# EasyEDA Pro project EasyEDA_Audio_Amp.epro

# Schematic Schematic1
Board Name: Board1; Create Date: 2026-08-29; Page Name: P1; Project Name: audio amp; Schematic Name: Schematic1; Update Date: 2026-08-30; Company: EasyEDA.com; Page Size: A4; Version: V1.0
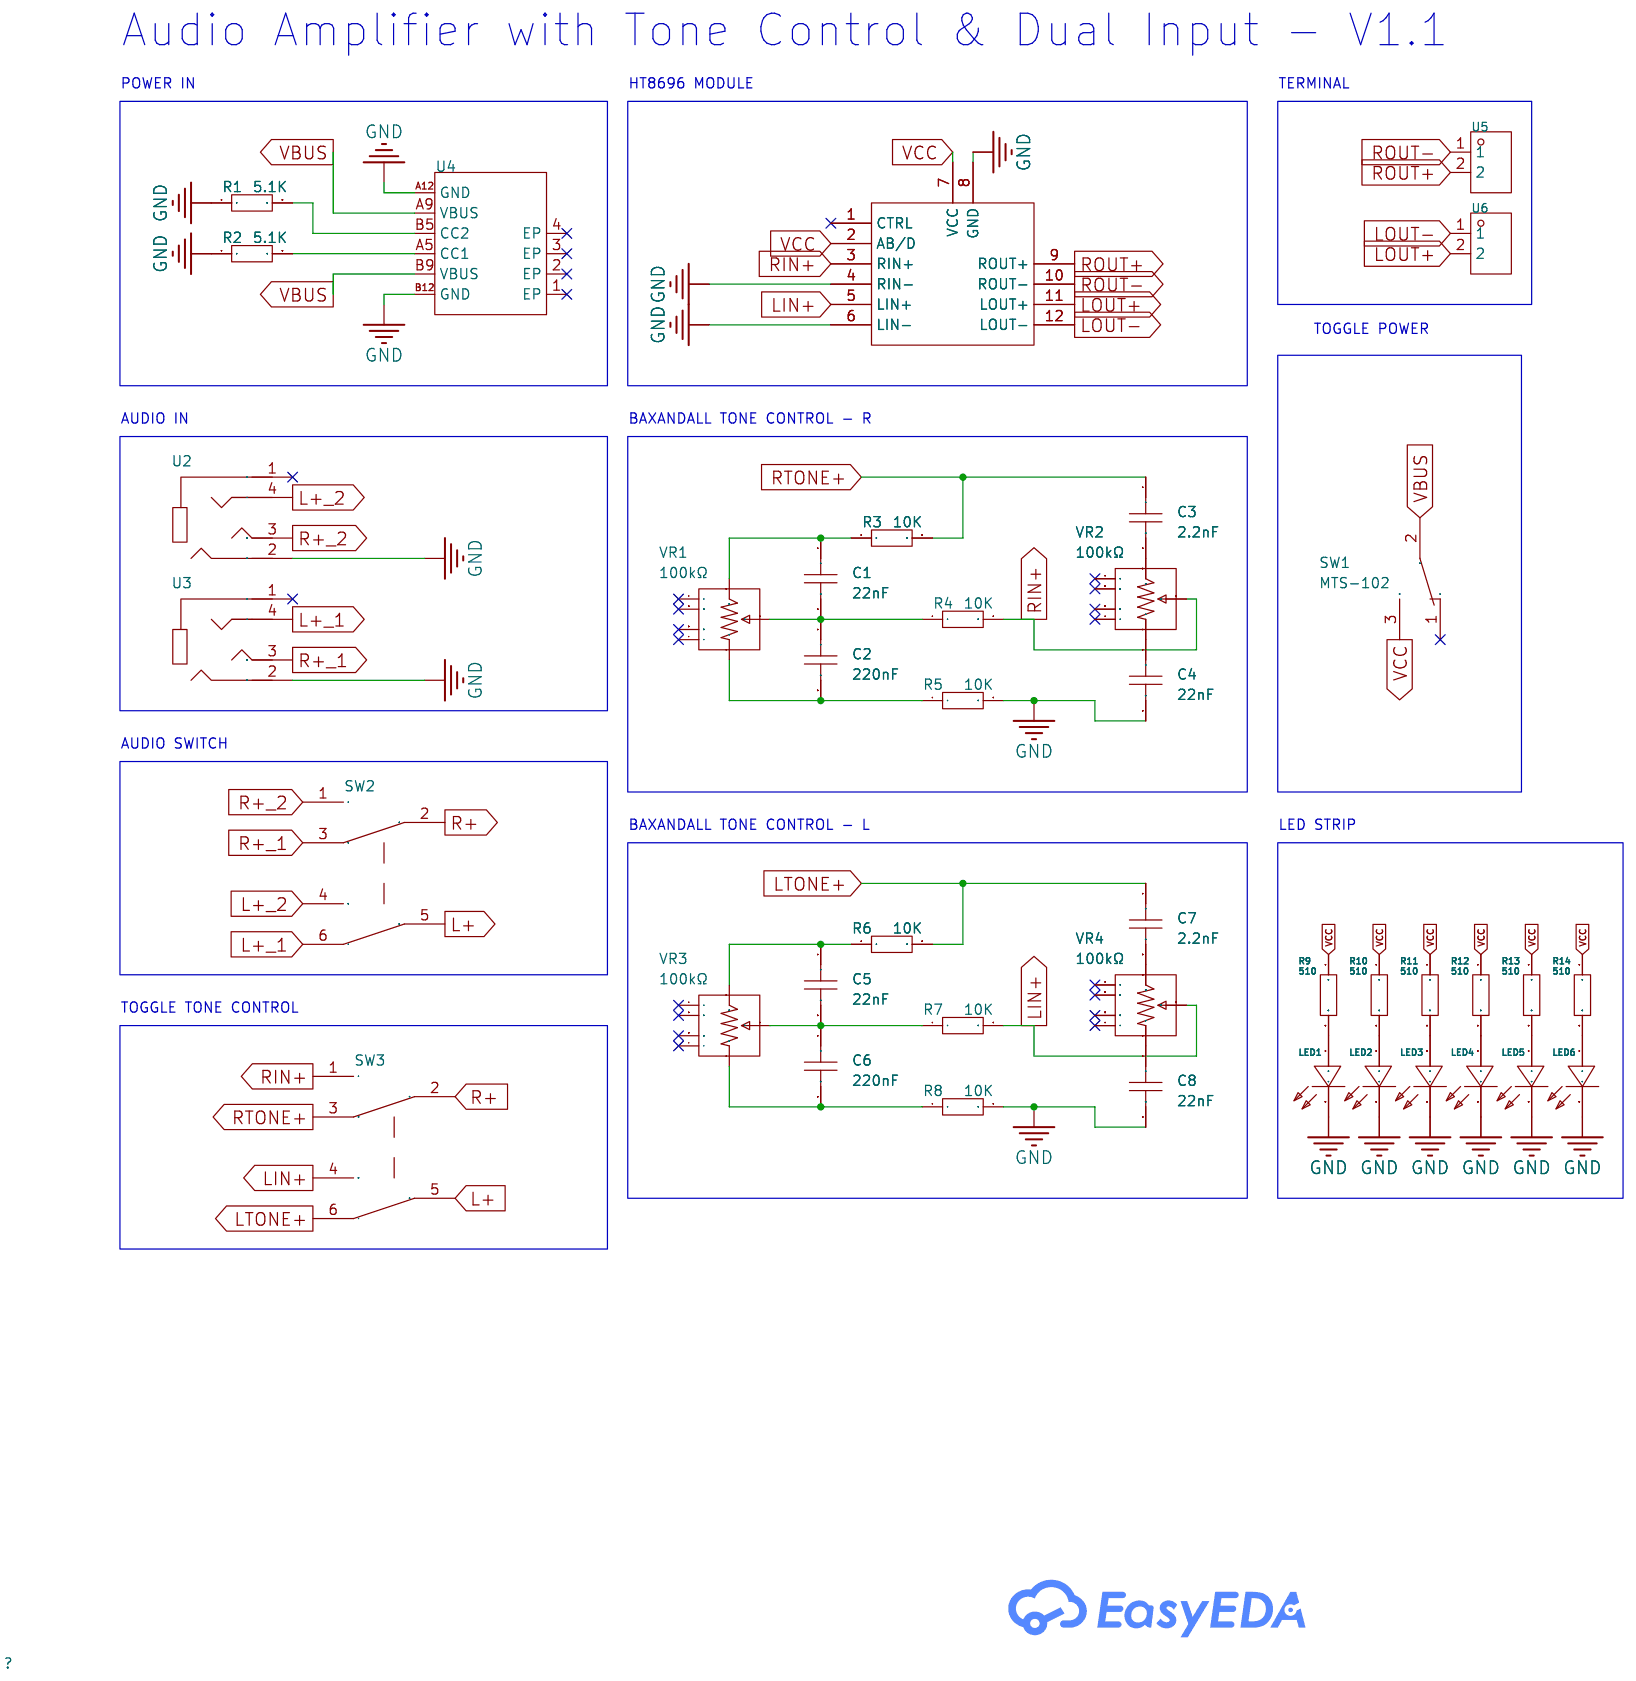
[diagram p0: schematic sheet]

## Parts
C1  22nF  [C0805]
C2  220nF  [C0805]
C3  2.2nF  [C0805]
C4  22nF  [C0805]
C5  22nF  [C0805]
C6  220nF  [C0805]
C7  2.2nF  [C0805]
C8  22nF  [C0805]
LED1  KT-0805G  [LED0805-R-RD]
LED2  KT-0805G  [LED0805-R-RD]
LED3  KT-0805G  [LED0805-R-RD]
LED4  KT-0805G  [LED0805-R-RD]
LED5  KT-0805G  [LED0805-R-RD]
LED6  KT-0805G  [LED0805-R-RD]
R1  5.1K  [R0805]
R2  5.1K  [R0805]
R3  10K  [R0805]
R4  10K  [R0805]
R5  10K  [R0805]
R6  10K  [R0805]
R7  10K  [R0805]
R8  10K  [R0805]
R9  510  [R0805]
R10  510  [R0805]
R11  510  [R0805]
R12  510  [R0805]
R13  510  [R0805]
R14  510  [R0805]
SW1  MTS-102  [MTS-102]
SW2  -  [MTS-202-A1]
SW3  -  [MTS-202-A1]
U1  -  [HT8696/7 Module]
U2  KH-PJ-320D-SMT  [AUDIO-SMD_KH-PJ-320D-SMT_1]
U3  KH-PJ-320D-SMT  [AUDIO-SMD_KH-PJ-320D-SMT_1]
U4  HX TYPE-C 6PIN DT  [TYPE-C-SMD_TYPE-C-31-M-16]
U5  KF301-5.0-2P  [CONN-TH_P5.00_KF301-5.0-2P]
U6  KF301-5.0-2P  [CONN-TH_P5.00_KF301-5.0-2P]
VR1  100kΩ  [RES-ADJ-TH_PTA6043-2015DPB103]
VR2  100kΩ  [RES-ADJ-TH_PTA6043-2015DPB103]
VR3  100kΩ  [RES-ADJ-TH_PTA6043-2015DPB103]
VR4  100kΩ  [RES-ADJ-TH_PTA6043-2015DPB103]

## Library data of the parts
C1-C8 = CAP_0603: Supplier Footprint: 0603
LED1-LED6 = Led Rosso 0805: LCSC Part Name: 0805 翠绿 高亮; Supplier Part: C2297; Manufacturer: KENTO; Supplier Footprint: 0805; JLCPCB Part Class: Basic Part; Datasheet: https://atta.szlcsc.com/upload/public/pdf/source/20170209/1486607340485.pdf; Supplier: LCSC; Emitted Color: Emerald
R1 R2 = 0805W8F2002T5E: Type:Thick Film Resistor Resistance:20kΩ Tolerance:±1% Tolerance:±1% Power(Watts):125mW Voltage-Supply(Max):150V Temperature Coefficient:±100ppm/℃ Temperature Coefficient:±100ppm/℃ Operating Temperature:-55℃~+155℃ Operating Temperature:-55℃~+155℃; LCSC Part Name: 厚膜电阻 20kΩ ±1%; Supplier Part: C4328; Manufacturer: UNI-ROYAL(厚声); Supplier Footprint: 0805; JLCPCB Part Class: Basic Part; Datasheet: https://item.szlcsc.com/datasheet/0805W8F2002T5E/4735.html; Supplier: LCSC; Type: Thick Film Resistor; Tolerance: ±1%; Power(Watts): 125mW; Voltage-Supply(Max): 150V; Temperature Coefficient: ±100ppm/℃; Operating Temperature: -55℃~+155℃
R3-R14 = Res_0603: Supplier Footprint: 0603
SW1 = MTS-102: _: 3
SW2 SW3 = MTS-202-A1_MOD
U1 = HT8696/7 Module
U2 U3 = KH-PJ-320D-SMT: Connector Type:3.5mm Headphone Jack Contact Material:Tin bronze Contact Plating:Silver; LCSC Part Name: 3.5mm耳机座; Supplier Part: C5123147; Manufacturer: kinghelm(金航标); Supplier Footprint: SMD; JLCPCB Part Class: Extended Part; Datasheet: https://item.szlcsc.com/datasheet/KH-PJ-320D-SMT/5715561.html; Supplier: LCSC; Connector Type: 3.5mm Headphone Jack; Contact Material: Tin bronze; Contact Plating: Silver
U4 = HX TYPE-C 6PIN DT: Connector Type:Type-C Gender:Female Mounting Style:Horizontal attachment Number of Contacts:6P Number of Ports:1 Current Rating - Power (Max):3A Rated Voltage (Max):20V Connect-Disconnect Life:5000 Cuts Center Height:1.68mm Length:6.8mm Core Colour:Black; LCSC Part Name: Type-C 母 卧贴; Supplier Part: C18357554; Manufacturer: hanxia(韩下); Supplier Footprint: SMD; JLCPCB Part Class: Extended Part; Datasheet: https://atta.szlcsc.com/upload/public/pdf/source/20240715/9DA76AB0C307AE71049E18D789077764.pdf; Supplier: LCSC; Connector Type: Type-C; Gender: Female; Mounting Style: Horizontal attachment; Number of Contacts: 6P; Number of Ports: 1; Current Rating - Power (Max): 3A; Rated Voltage (Max): 20V; Connect-Disconnect Life: 5000 Cuts; Center Height: 1.68mm; Length: 6.8mm; Core Colour: Black; Operating Temperature Range: -30℃~+80℃
U5 U6 = KF301-5.0-2P: Number of Positions or Pins:1x2P Pitch:5mm Color:Blue Mounting Type:Through Hole Number of Pins:2P Number of Rows:1 Number of PINs Per Row:2 Screw Specification:M2.5 Current Rating:17A Voltage Rating (Max):250V Wire Gauge - AWG:14~22 Wire Gauge - mm2:1.5; LCSC Part Name: 1x2P 5mm 直插 排数:1 每排P数:2; Supplier Part: C474881; Manufacturer: KEFA(科发); Supplier Footprint: 插件,P=5mm; JLCPCB Part Class: Extended Part; Datasheet: https://item.szlcsc.com/datasheet/KF301-5.0-2P/481499.html; Supplier: LCSC; Number of Positions or Pins: 1x2P; Pitch: 5mm; Color: Blue; Mounting Type: Through Hole; Number of Pins: 2P; Number of Rows: 1; Number of PINs Per Row: 2; Screw Specification: M2.5; Current Rating: 17A; Voltage Rating (Max): 250V; Wire Gauge - AWG: 14~22; Wire Gauge - mm2: 1.5; Operating Temperature: -30℃~+120℃; Height Above Board: 10mm
VR1-VR4 = PTA6043-2015CPB103: Resistance:10kΩ Tolerance:±20% Tolerance:±20% Voltage Rating:200V Power(Watts):250mW; LCSC Part Name: 10kΩ ±20%; Supplier Part: C17203852; Manufacturer: BOURNS; Supplier Footprint: 插件; JLCPCB Part Class: Extended Part; Datasheet: https://item.szlcsc.com/datasheet/PTA6043-2015CPB103/18332919.html; Supplier: LCSC; Tolerance: ±20%; Voltage Rating: 200V; Power(Watts): 250mW

## Nets
GND: C4.2 C8.2 LED1.2(K) LED2.2(K) LED3.2(K) LED4.2(K) LED5.2(K) LED6.2(K) R1.1 R2.1 R5.2 R8.2 U1.4(RIN-) U1.6(LIN-) U1.8(GND) U2.2 U3.2 U4.A12(GND) U4.B12(GND)
VBUS: SW1.2 U4.A9(VBUS) U4.B9(VBUS)
VCC: R9.1 R10.1 R11.1 R12.1 R13.1 R14.1 SW1.3 U1.2(AB/D) U1.7(VCC)
L+: SW2.5 SW3.5
L+_1: SW2.6(4) U3.4
L+_2: SW2.4(6) U2.4
LIN+: R7.2 SW3.4(6) U1.5(LIN+) VR4.2
LOUT+: U1.11(LOUT+) U6.2
LOUT-: U1.12(LOUT-) U6.1
LTONE+: C7.1 R6.2 SW3.6(4)
R+: SW2.2 SW3.2
R+_1: SW2.3 U3.3
R+_2: SW2.1 U2.3
RIN+: R4.2 SW3.1 U1.3(RIN+) VR2.2
ROUT+: U1.9(ROUT+) U5.2
ROUT-: U1.10(ROUT-) U5.1
RTONE+: C3.1 R3.2 SW3.3
$1N1190: R2.2 U4.A5(CC1)
$1N1200: R1.2 U4.B5(CC2)
$1N2858: C1.1 R3.1 VR1.3
$1N2879: C2.2 R5.1 VR1.1
$1N2967: C1.2 C2.1 R4.1 VR1.2
$1N3051: C3.2 VR2.3
$1N3077: C4.1 VR2.1
$1N3711: C8.1 VR4.1
$1N3729: C7.2 VR4.3
$1N3731: C5.1 R6.1 VR3.3
$1N3735: C5.2 C6.1 R7.1 VR3.2
$1N3738: C6.2 R8.1 VR3.1
$1N10006: LED2.1(A) R10.2
$1N10008: LED1.1(A) R9.2
$1N10010: LED3.1(A) R11.2
$1N10420: LED6.1(A) R14.2
$1N10422: LED5.1(A) R13.2
$1N10424: LED4.1(A) R12.2

Not connected (* = marked no-connect by the designer): SW1 1*; U1 1(CTRL)*; U2 1*; U3 1*; U4 1(EP)* 2(EP)* 3(EP)* 4(EP)*; VR1 4* 5* 6* 7*; VR2 4* 5* 6* 7*; VR3 4* 5* 6* 7*; VR4 4* 5* 6* 7*

## Notes on the sheet
- Audio Amplifier with Tone Control & Dual Input - V1.1
- POWER IN
- HT8696 MODULE
- TERMINAL
- TOGGLE POWER
- AUDIO IN
- BAXANDALL TONE CONTROL - R
- AUDIO SWITCH
- BAXANDALL TONE CONTROL - L
- LED STRIP
- TOGGLE TONE CONTROL

# Board PCB1
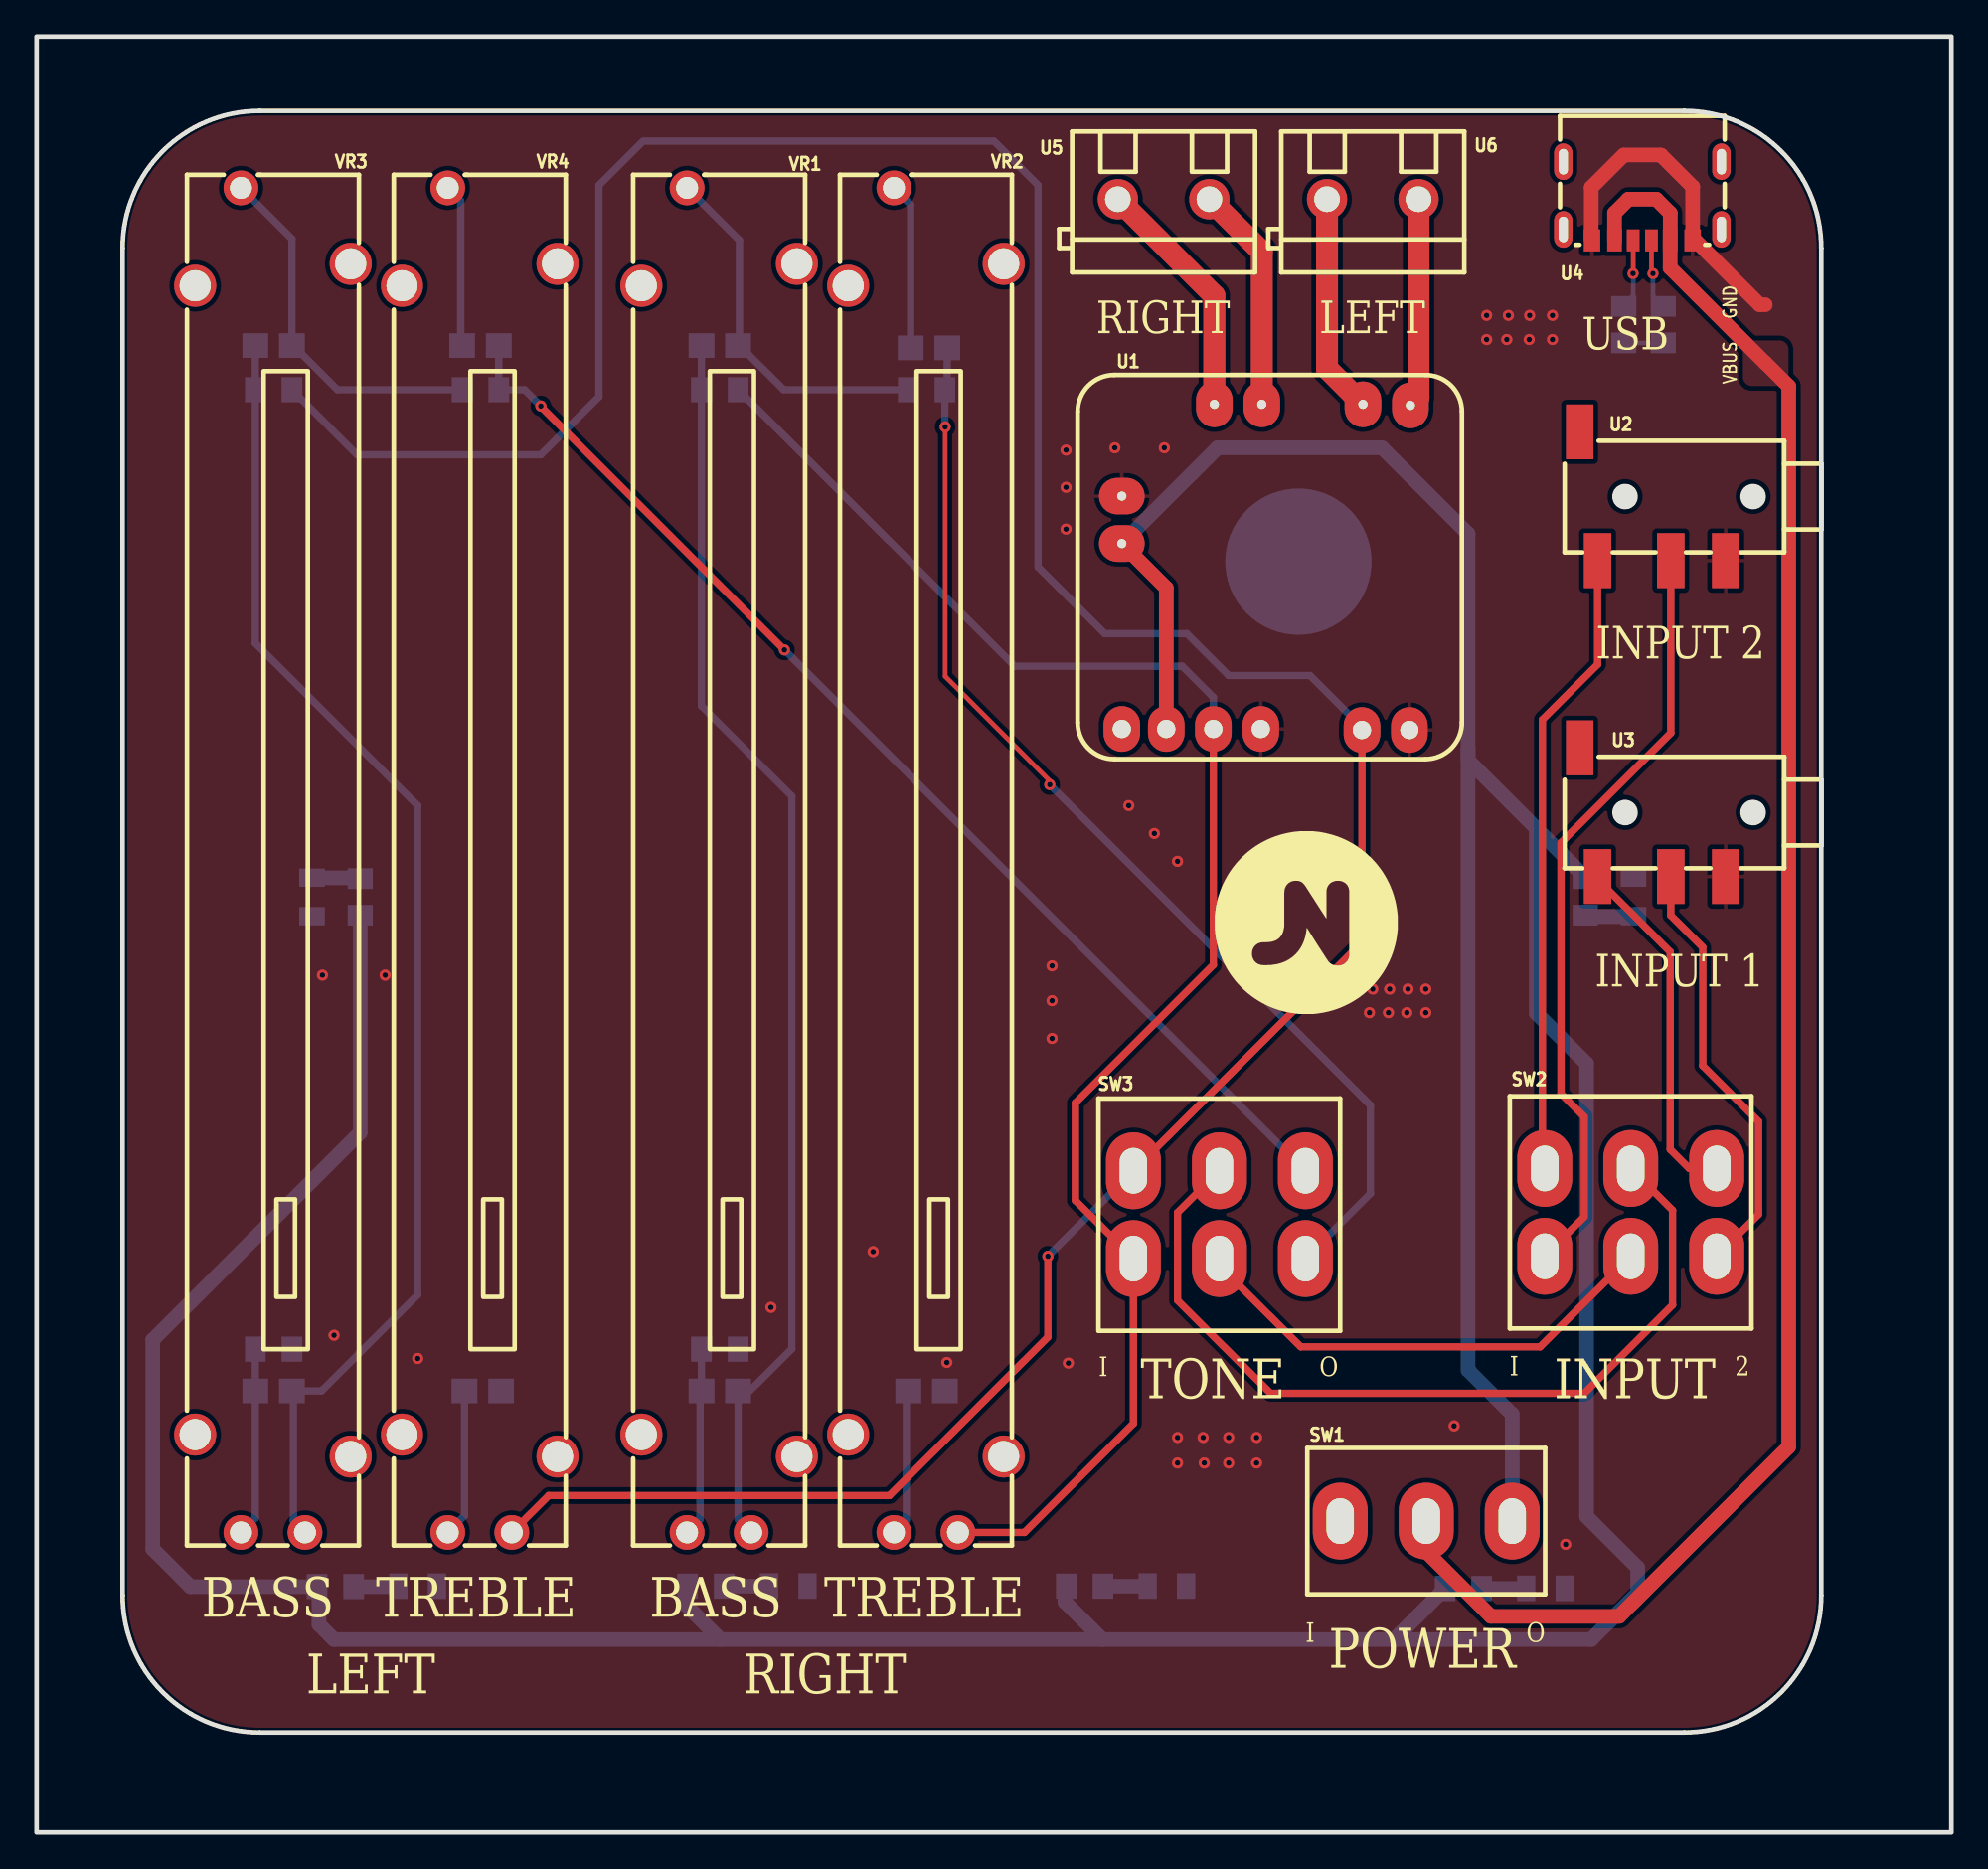
[diagram p1: board, top side]
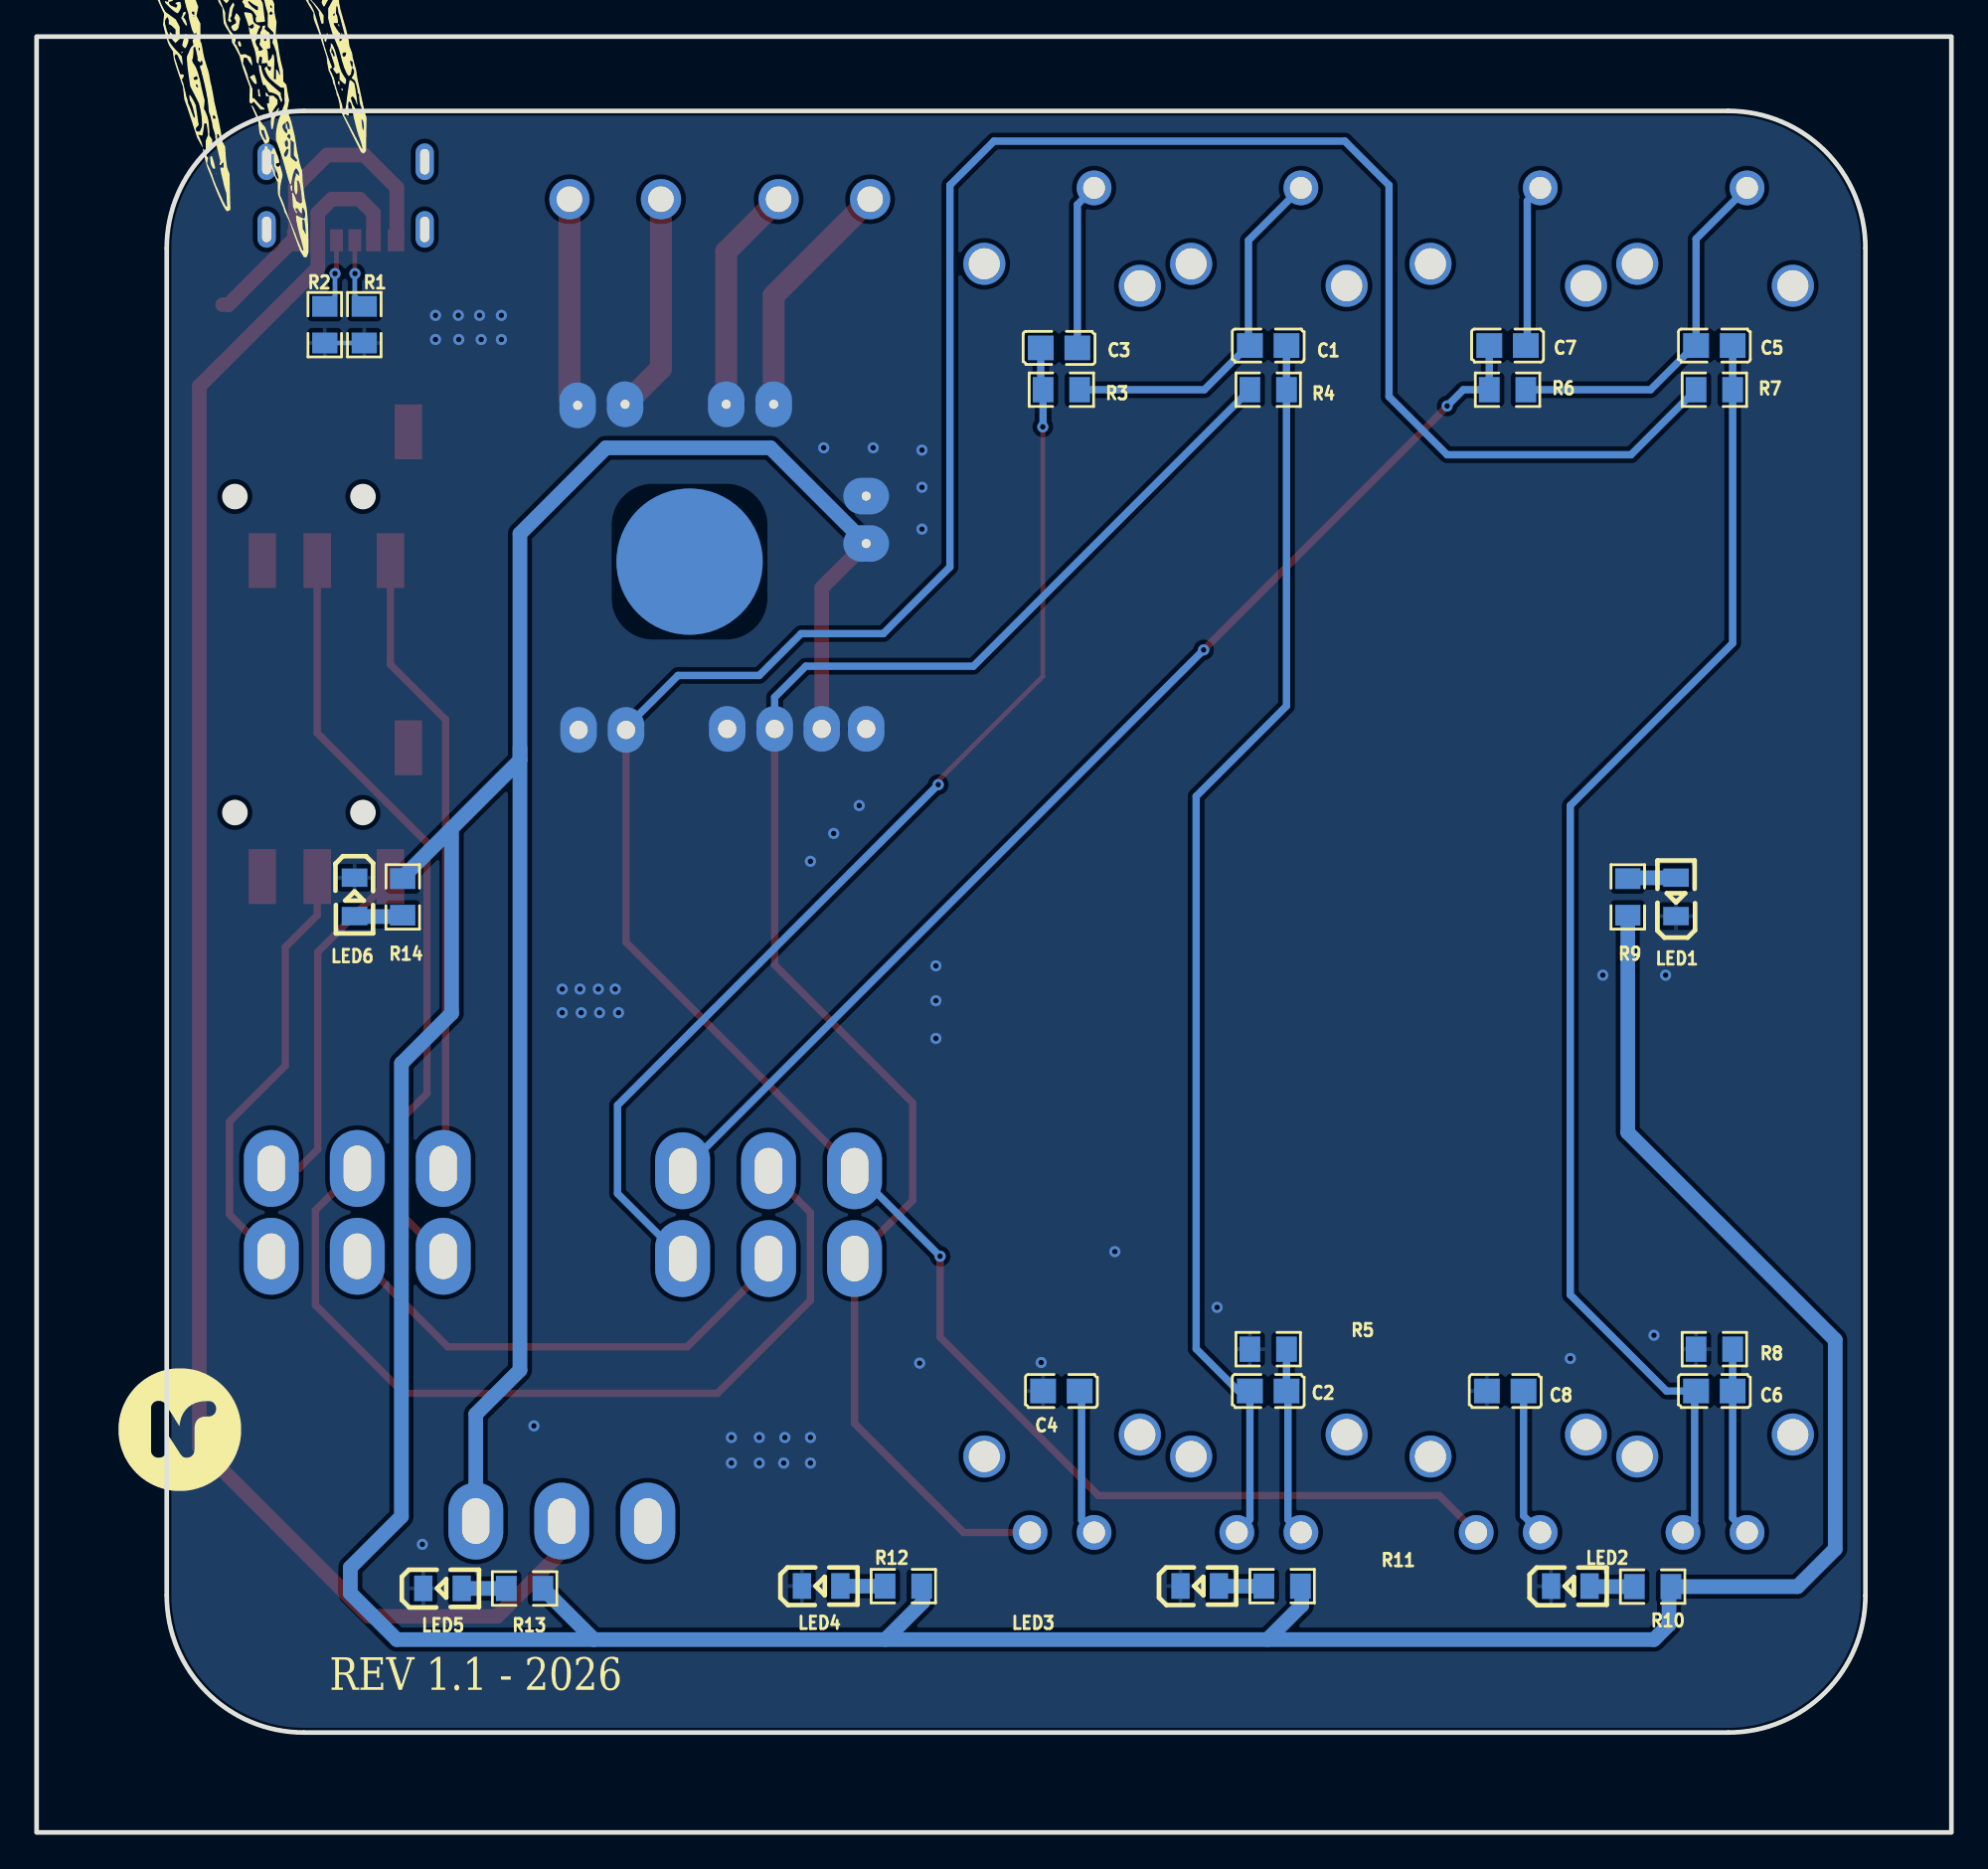
[diagram p2: board, bottom side, seen from below]

Outline 104.65 x 98.17 mm; copper layers: Top Layer, Bottom Layer. Coordinates in mm from the lower left corner of the outline.
Outline path: rectangle 0,98.17 104.65,0 ; 4.7,86.61 4.7,12.96 arc(6.9,7.66) 12.2,5.46 90.04,5.46 arc(95.34,7.66) 97.54,12.96 97.54,86.61 arc(95.34,91.91) 90.04,94.11 12.2,94.11 arc(6.9,91.91) 4.7,86.61
Stack: Top Layer 0.035mm / Dielectric1 1.51mm FR4 er 4.5 / Bottom Layer 0.035mm

## Design rules (mm)
template: JLCPCB Capability(Two Layers Board)
spacing copperThickness1oz (default): track to track 0.102, other pairs 0.152 to 0.3
spacing copperThickness2oz: track to track 0.203, other pairs 0.152 to 0.3
track width copperThickness1oz (default): min 0.127, default 0.254, max 2.54
track width copperThickness2oz: min 0.203, default 0.254, max 2.54
differential pair differentialPair (default): width min 0.127, default 0.254, max 2.54; gap min 0.152, default 0.152
via viaSize (default): diameter min 0.5, default 0.61, max 10; hole min 0.3, default 0.305, max 6.3

## Placement (name value [footprint] x y rotation side)
C1  22nF  [C0805]  37.34 81.28 180 bottom
C2  220nF  [C0805]  37.34 24.13 180 bottom
C3  2.2nF  [C0805]  48.77 81.15 180 bottom
C4  22nF  [C0805]  48.64 24.13 0 bottom
C5  22nF  [C0805]  12.95 81.28 180 bottom
C6  220nF  [C0805]  12.95 24.13 180 bottom
C7  2.2nF  [C0805]  24.26 81.28 180 bottom
C8  22nF  [C0805]  24.38 24.13 0 bottom
LED1  KT-0805G  [LED0805-R-RD]  15.05 51.14 90 bottom
LED2  KT-0805G  [LED0805-R-RD]  20.83 13.46 180 bottom
LED3  KT-0805G  [LED0805-R-RD]  41.08 13.47 180 bottom
LED4  KT-0805G  [LED0805-R-RD]  61.77 13.47 180 bottom
LED5  KT-0805G  [LED0805-R-RD]  82.46 13.34 180 bottom
LED6  KT-0805G  [LED0805-R-RD]  87.27 51.14 270 bottom
NOREF  -  [Pad_e38]  68.96 69.47 0 top
R1  5.1K  [R0805]  86.74 82.42 90 bottom
R2  5.1K  [R0805]  88.9 82.42 90 bottom
R3  10K  [R0805]  48.64 78.87 0 bottom
R4  10K  [R0805]  37.34 78.87 0 bottom
R5  10K  [R0805]  37.34 26.42 0 bottom
R6  10K  [R0805]  24.26 78.87 0 bottom
R7  10K  [R0805]  12.95 78.87 0 bottom
R8  10K  [R0805]  12.95 26.42 0 bottom
R9  510  [R0805]  17.69 51.14 90 bottom
R10  510  [R0805]  16.33 13.44 0 bottom
R11  510  [R0805]  36.58 13.46 0 bottom
R12  510  [R0805]  57.28 13.46 0 bottom
R13  510  [R0805]  77.98 13.33 0 bottom
R14  510  [R0805]  84.64 51.14 270 bottom
SW1  -  [MTS-102]  75.95 17.02 90 top
SW2  -  [MTS-202-A1]  93.73 27.43 180 top
SW3  -  [MTS-202-A1]  71.25 27.3 180 top
U1  -  [HT8696/7 Module]  56.9 58.67 90 top
U2  KH-PJ-320D-SMT  [AUDIO-SMD_KH-PJ-320D-SMT_1]  88.01 73.02 180 top
U3  KH-PJ-320D-SMT  [AUDIO-SMD_KH-PJ-320D-SMT_1]  88.01 55.75 180 top
U4  HX TYPE-C 6PIN DT  [TYPE-C-SMD_TYPE-C-31-M-16]  87.76 89.28 180 top
U5  KF301-5.0-2P  [CONN-TH_P5.00_KF301-5.0-2P]  61.59 89.28 180 top
U6  KF301-5.0-2P  [CONN-TH_P5.00_KF301-5.0-2P]  73.02 89.28 180 top
VR1  100kΩ  [RES-ADJ-TH_PTA6043-2015DPB103]  37.3 53.15 90 top
VR2  100kΩ  [RES-ADJ-TH_PTA6043-2015DPB103]  48.6 53.15 90 top
VR3  100kΩ  [RES-ADJ-TH_PTA6043-2015DPB103]  12.92 53.15 90 top
VR4  100kΩ  [RES-ADJ-TH_PTA6043-2015DPB103]  24.22 53.15 90 top

## Footprints (pads in the part's own frame, mm; a bottom-side part is the same pattern mirrored in y, then rotated)
AUDIO-SMD_KH-PJ-320D-SMT_1
  rect 1.5x3 smd: 1(3.678,-3.538) 2(-4.3,3.5) 3(-1.3,3.5) 4(2.7,3.5)
C0805
  rect 1.41x1.35 smd: 1(-1,0) 2(1,0)
CONN-TH_P5.00_KF301-5.0-2P
  round 2.2 hole 1.4: 1(-2.5,0) 2(2.5,0)
HT8696/7 Module
  rrect 2.5x2 hole 1x0.5: 1(1.651,-2.413) 2(1.651,-4.843) 3(1.651,-7.416) 4(1.651,-10.008) 5(1.594,-15.538) 6(1.594,-18.131)
  rrect 2x2.5 hole 0.5: 7(11.784,-2.413) 8(14.377,-2.413)
  rrect 2.5x2 hole 0.5: 9(19.396,-7.47) 10(19.396,-10.062) 11(19.396,-15.591) 12(19.339,-18.184)
LED0805-R-RD
  rect 1x1.399 smd: 1(1.05,0) 2(-1.05,0)
MTS-102
  oval 4.2x3 hole 2.5x1.5: 1(0,4.7) 2(0,0) 3(0,-4.7)
MTS-202-A1
  oval 3x4.2 hole 1.5x2.5: 1(11.303,-4.064) 2(6.604,-4.064) 3(1.905,-4.064) 4(11.303,-8.864) 5(6.604,-8.864) 6(1.905,-8.864)
Pad_e38
  rrect 8x8 smd far side: 1(0,0)
R0805
  rect 1.133x1.377 smd: 1(-1,0) 2(1,0)
RES-ADJ-TH_PTA6043-2015DPB103
  round 1.9 hole 1.2: 1(-36.75,1.75) 2(-36.75,-1.75) 3(36.75,1.75)
  round 2.3 hole 1.7: 4(-31.4,4.25) 5(31.4,4.25) 6(-32.6,-4.25) 7(32.6,-4.25)
TYPE-C-SMD_TYPE-C-31-M-16
  oval 1x2 hole 0.5x1.4: 1(-4.32,1.65) 2(4.32,1.65) 3(-4.32,-2.05) 4(4.32,-2.05)
  rect 0.7x1.2 smd: A5(-0.5,2.25) B5(0.5,2.25)
  rect 0.8x1.2 smd: A9(1.52,2.25) B9(-1.52,2.25)
  rect 0.9x1.2 smd: A12(2.75,2.25) B12(-2.75,2.25)

## Nets
As in the schematic.

Pads without a net: NOREF 1; SW1 1; U1 1; U2 1; U3 1; U4 1 2 3 4; VR1 4 5 6 7; VR2 4 5 6 7; VR3 4 5 6 7; VR4 4 5 6 7

## Via types
v1: diameter 0.61, hole 0.305, Top Layer to Bottom Layer, 52 vias

## Routing (per net, layer and track width the routed paths; a pad name or vN(x,y) marks a point on that pad's centre or on a via; arc(x,y) is an arc through that point)
GND: length 20.3
  Top Layer w0.8: 84.96,87.13 84.96,89.92 86.74,91.69 88.77,91.69 90.51,89.96 90.51,87.13 ; 90.51,87.17 94.17,83.51 94.48,83.51
  Bottom Layer w0.254: R1.1 R2.1
  vias: v1(15.62,46.86) v1(16.26,27.18) v1(19.05,46.86) v1(20.83,25.91) v1(40.13,28.7) v1(45.72,31.75) v1(49.75,25.69) v1(55.5,47.37) v1(55.5,45.47) v1(55.5,43.4) v1(56.26,75.56) v1(56.26,73.53) v1(56.26,71.25) v1(56.39,25.65) v1(58.93,75.69) v1(59.69,56.13) v1(61.09,54.61) v1(61.63,75.69) v1(62.36,53.09) v1(62.36,21.59) v1(62.36,20.19) v1(63.75,21.59) v1(63.82,20.19) v1(65.15,21.59) v1(65.15,20.19) v1(66.67,21.59) v1(66.67,20.19) v1(72.84,44.81) v1(73.02,46.1) v1(73.95,46.1) v1(73.88,44.81) v1(74.95,46.1) v1(74.88,44.81) v1(75.92,46.1) v1(75.92,44.81) v1(77.47,22.22) v1(79.25,82.93) v1(79.25,81.61) v1(80.35,81.61) v1(80.44,82.93) v1(81.6,82.93) v1(81.58,81.61) v1(82.85,82.93) v1(82.85,81.61) v1(83.57,15.75)
LIN+: length 173.5
  Top Layer w0.4: VR4.2 27.99,18.41 46.61,18.41 55.27,27.08 v1(55.27,31.5) ; SW3.4 72.43,48.66 U1.5
  Bottom Layer w0.4: R7.2 17.51,75.31 27.56,75.31 30.73,78.49 30.73,90.04 33.15,92.46 52.32,92.46 54.73,90.05 54.73,69.17 58.38,65.53 62.86,65.53 65.15,63.25 69.6,63.25 72.43,60.41 U1.5 ; 55.24,31.5 v1(55.27,31.5) SW3.4
LTONE+: length 64.2
  Top Layer w0.4: v1(27.56,77.98) 27.56,77.95 v1(40.87,64.64)
  Bottom Layer w0.4: C7.1 R6.2 ; 25.33,78.87 26.67,78.87 v1(27.56,77.98) ; 40.77,64.64 v1(40.87,64.64) SW3.6
RTONE+: length 60.7
  Top Layer w0.254: v1(49.66,76.83) 49.66,63.2 55.37,57.48
  Bottom Layer w0.4: R3.2 49.64,76.85 v1(49.66,76.83) ; C3.1 49.77,78.87 ; 69.34,31.37 72.9,34.92 72.9,39.75 v1(55.37,57.28)
$1N1190: length 3.9
  Top Layer w0.254: U4.A5 88.26,85.3 v1(88.34,85.22)
  Bottom Layer w0.254: v1(88.34,85.22) 88.34,83.98 R2.2
$1N1200: length 3.8
  Top Layer w0.254: U4.B5 87.26,85.22 v1(87.25,85.22)
  Bottom Layer w0.254: 87.26,85.22 87.26,84.01 86.74,83.5
VBUS: length 102
  Top Layer w0.8: 75.95,17.02 75.95,15.35 79.48,11.81 86.49,11.81 95.76,21.08 95.76,79.06 94.5,80.32 ; U4.A9 86.24,88.52 86.99,89.28 88.52,89.28 89.28,88.52 89.28,87.13 ; U4.B9 89.28,85.53 94.49,80.32
VCC: length 279
  Top Layer w0.8: U1.7 61.74,68.03 U1.2
  Bottom Layer w0.8: 15.26,13.44 8.41,13.44 6.35,15.49 6.35,26.92 17.69,38.26 17.69,50.07 ; 15.43,13.43 15.43,11.36 16.26,10.54 74.18,10.54 ; 35.5,13.46 35.5,12.42 37.38,10.54 ; 56.2,13.46 56.2,12.6 58.26,10.54 ; U1.7 64.54,75.69 73.53,75.69 78.23,70.99 78.23,25.27 80.65,22.86 SW1.3 ; 74.18,10.54 R13.1 ; 74.18,10.54 84.96,10.54 87.5,13.08 87.5,14.48 84.71,17.27 84.71,42.04 81.97,44.78 81.97,54.88 ; 78.23,59.29 78.23,58.62 84.64,52.21
L+: length 47.6
  Top Layer w0.4: SW3.5 62.36,33.88 62.36,29.08 67.44,24 84.58,24 89.41,28.83 89.41,34.01 SW2.5
L+_1: length 19.4
  Top Layer w0.4: 85.31,52.1 89.28,48.13 89.28,37.34 90.32,36.3 SW2.6
L+_2: length 34.3
  Top Layer w0.4: SW2.4 82.3,36.42 82.3,60.83 85.31,63.85 85.31,69.32
LOUT+: length 12
  Top Layer w1.2: U6.2 70.52,80.03 U1.11
LOUT-: length 11.5
  Top Layer w1.2: U1.12 75.52,78.46 U6.1
R+: length 27
  Top Layer w0.4: 64.64,31.64 64.64,30.99 69.09,26.54 82.17,26.54 SW2.2
R+_1: length 23.7
  Top Layer w0.4: U3.3 89.31,50.13 91.06,48.39 91.06,41.91 94.11,38.86 94.11,33.78 SW2.3
R+_2: length 41.9
  Top Layer w0.4: SW2.1 84.58,33.65 84.58,39.12 83.31,40.39 83.31,54.1 89.31,60.1 U2.3
RIN+: length 89.1
  Top Layer w0.4: 50.42,16.26 50.56,16.4 53.99,16.4 59.94,22.36 59.94,31.37 56.77,34.54 56.77,39.88 64.31,47.42 U1.3
  Bottom Layer w0.4: R4.2 53.45,63.75 62.61,63.75 64.31,62.05 U1.3
ROUT+: length 13.4
  Top Layer w1.2: U5.2 64.37,84.01 U1.9
ROUT-: length 12.2
  Top Layer w1.2: U5.1 66.96,86.42 66.96,78.31
$1N2858: length 20
  Bottom Layer w0.4: VR1.3 38.42,87.03 38.42,81.28 40.83,78.87 R3.1
$1N2879: length 10.3
  Bottom Layer w0.4: 35.55,16.4 36.26,17.11 36.26,24.13 ; C2.2 R5.1
$1N2967: length 68.2
  Bottom Layer w0.4: C1.2 R4.1 36.34,61.58 41.27,56.64 41.27,26.43 38.97,24.13 ; C2.1 38.34,17.11 VR1.2
$1N3051: length 9.1
  Bottom Layer w0.4: VR2.3 47.77,88.99 C3.2
$1N3077: length 8
  Bottom Layer w0.4: VR2.1 47.54,17.08 47.54,24.13
$1N3711: length 8.1
  Bottom Layer w0.4: VR4.1 23.38,17.31 C8.1
$1N3729: length 8.9
  Bottom Layer w0.4: VR4.3 23.18,89.19 23.18,81.28
$1N3731: length 20
  Bottom Layer w0.4: VR3.3 13.95,87.11 C5.1 ; 14.03,81.28 16.44,78.87 R6.1
$1N3735: length 72.6
  Bottom Layer w0.4: C5.2 R7.1 11.95,65.01 20.83,56.13 20.83,29.39 15.57,24.13 C6.1 ; 14.03,24.13 14.03,17.03 VR3.2
$1N3738: length 10.3
  Bottom Layer w0.4: VR3.1 11.95,17.19 C6.2 11.95,26.4 11.94,26.42
$1N10006: length 2.4
  Bottom Layer w0.8: 17.4,13.44 19.79,13.44 19.81,13.46
$1N10008: length 2.7
  Bottom Layer w0.8: 15.01,52.18 17.69,52.18
$1N10010: length 2.5
  Bottom Layer w0.8: R11.2 40.08,13.46
$1N10420: length 2.8
  Bottom Layer w0.8: 84.64,50.06 87.28,50.06 87.38,50.16
$1N10422: length 2.4
  Bottom Layer w0.8: 79.05,13.33 81.42,13.33
$1N10424: length 2.4
  Bottom Layer w0.8: 58.35,13.46 60.73,13.46

## Copper pours and planes (outline as drawn; the poured copper is in the pictures)
GND on Top Layer: 93.23,84.76 95.73,84.76 95.73,82.26 93.23,82.26
GND on Top Layer: 0.76,100.46 101.35,100.46 101.35,-0.25 0.76,-0.25
GND on Bottom Layer: 1.27,101.73 102.11,101.73 102.11,-0.89 1.27,-0.89
VBUS on Top Layer: 93.25,81.57 95.75,81.57 95.75,79.07 93.25,79.07

## Text on the board
Bottom Silkscreen Layer: REV 1.1 - 2026
Top Silkscreen Layer: GND | VBUS | I | O | 2 | RIGHT | LEFT | USB | INPUT 1 | INPUT 2 | BASS | TREBLE | TONE | POWER | INPUT
